# EAGLE schematic AMP_OP (EAGLE 7.7.0)
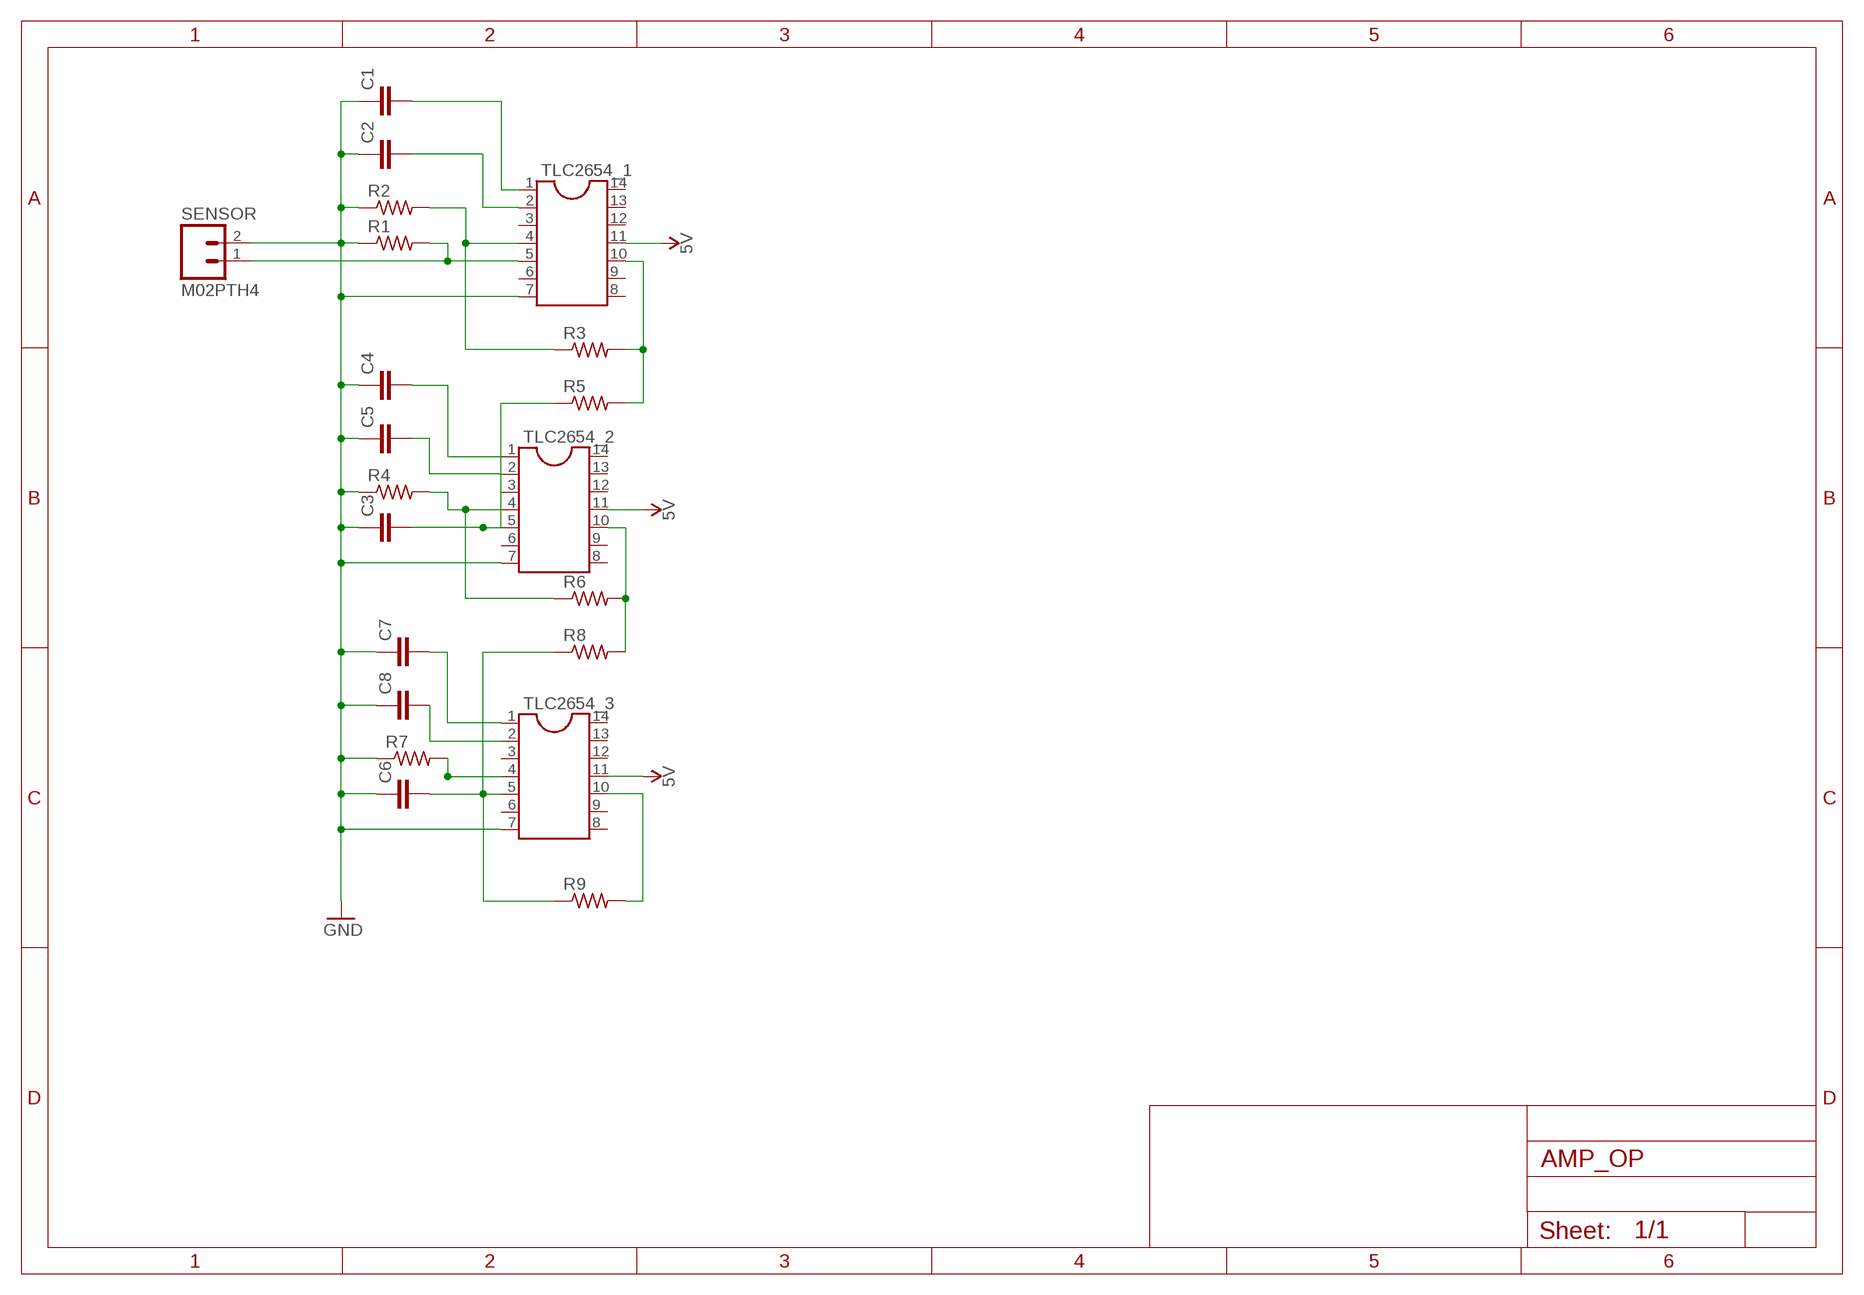
[diagram p0: schematic, sheet 1]

## Parts
C1  C5/3.5  [C5B3.5]
C2  C5/3.5  [C5B3.5]
C3  C5/3.5  [C5B3.5]
C4  C5/3.5  [C5B3.5]
C5  C5/3.5  [C5B3.5]
C6  C5/3.5  [C5B3.5]
C7  C5/3.5  [C5B3.5]
C8  C5/3.5  [C5B3.5]
R1  R-US_0207/9  [0207/9]
R2  R-US_0207/9  [0207/9]
R3  R-US_0207/9  [0207/9]
R4  R-US_0207/9  [0207/9]
R5  R-US_0207/9  [0207/9]
R6  R-US_0207/9  [0207/9]
R7  R-US_0207/9  [0207/9]
R8  R-US_0207/9  [0207/9]
R9  R-US_0207/9  [0207/9]
SENSOR  M02PTH4  [1X02_XTRA_BIG]
TLC2654_1  DIL14  [DIL14]
TLC2654_2  DIL14  [DIL14]
TLC2654_3  DIL14  [DIL14]

## Nets
5V: TLC2654_1.11 TLC2654_2.11 TLC2654_3.11
GND: C1.1 C2.1 C3.1 C4.1 C5.1 C6.1 C7.1 C8.1 R1.1 R2.1 R4.1 R7.1 SENSOR.2 TLC2654_1.7 TLC2654_2.7 TLC2654_3.7
N$1: C1.2 TLC2654_1.1
N$2: C2.2 TLC2654_1.2
N$3: C4.2 TLC2654_2.1
N$4: C5.2 TLC2654_2.2
N$5: C8.2 TLC2654_3.2
N$6: R2.2 R3.1 TLC2654_1.4
N$7: C7.2 TLC2654_3.1
N$8: R1.2 SENSOR.1 TLC2654_1.5
N$11: R3.2 R5.2 TLC2654_1.10
N$12: C3.2 R5.1 TLC2654_2.5
N$14: R4.2 R6.1 TLC2654_2.4
N$15: R7.2 TLC2654_3.4
N$16: C6.2 R8.1 R9.1 TLC2654_3.5
N$18: R6.2 R8.2 TLC2654_2.10
N$19: R9.2 TLC2654_3.10
Unconnected: TLC2654_1.3 TLC2654_1.6 TLC2654_1.8 TLC2654_1.9 TLC2654_1.12 TLC2654_1.13 TLC2654_1.14 TLC2654_2.3 TLC2654_2.6 TLC2654_2.8 TLC2654_2.9 TLC2654_2.12 TLC2654_2.13 TLC2654_2.14 TLC2654_3.3 TLC2654_3.6 TLC2654_3.8 TLC2654_3.9 TLC2654_3.12 TLC2654_3.13 TLC2654_3.14

## Library data of the parts
C1-C8 = capacitor-wima:C: CAPACITOR naming: grid - package width
R1-R9 = adafruit:R-US_: RESISTOR, American symbol
SENSOR = appfruits:M02: Standard 2-pin 0.1" header. Use with - straight break away headers ( PRT-00116) - right angle break away headers (PRT-00553) - swiss pins (PRT-00743) - machine pins (PRT-00117) - female headers (PRT-00115) Molex polarized connector foot print use with: PRT-08233 with associated crimp pins and housings. 2.54_SCREWTERM for use with PRT-10571. 3.5mm Screw Terminal footprints for PRT-08084 5mm Screw Terminal footprints for use with PRT-08432
TLC2654_1-TLC2654_3 = ic-package:DIL14: Dual In Line / Socket